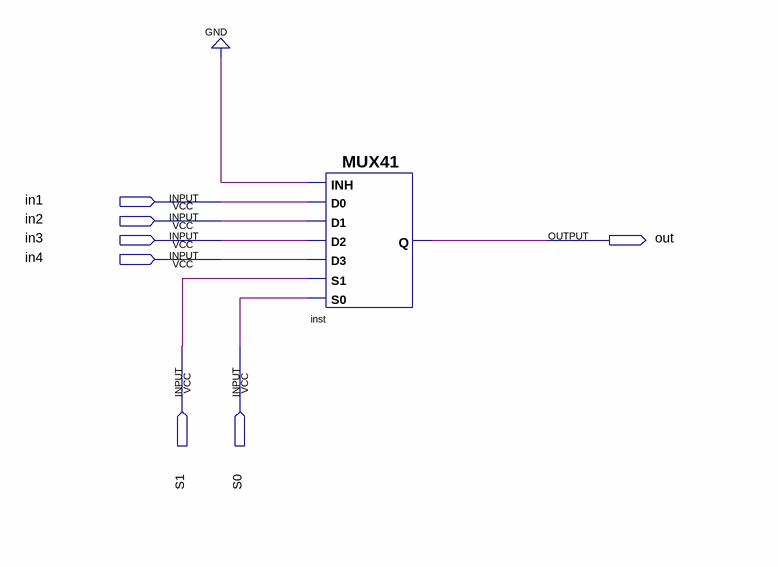
[diagram p0: schematic sheet]
// Quartus schematic MUX_4x1.bdf as structural Verilog: 1 symbols, 7 pins
module MUX_4x1 (
  input  in1,
  input  in2,
  input  in3,
  input  in4,
  input  S1,
  input  S0,
  output out
);

  MUX41 inst (.S0(S0), .D2(in3), .S1(S1), .D3(in4), .D0(in1), .INH(1'b0), .D1(in2), .Q(out));
endmodule
